# Altium schematic sheet Boost_Converter.SchDoc: Boost Converter Schematic
size A4; DrawnBy: Ian Glass; Revision: 1; SheetNumber: 2; SheetTotal: 3
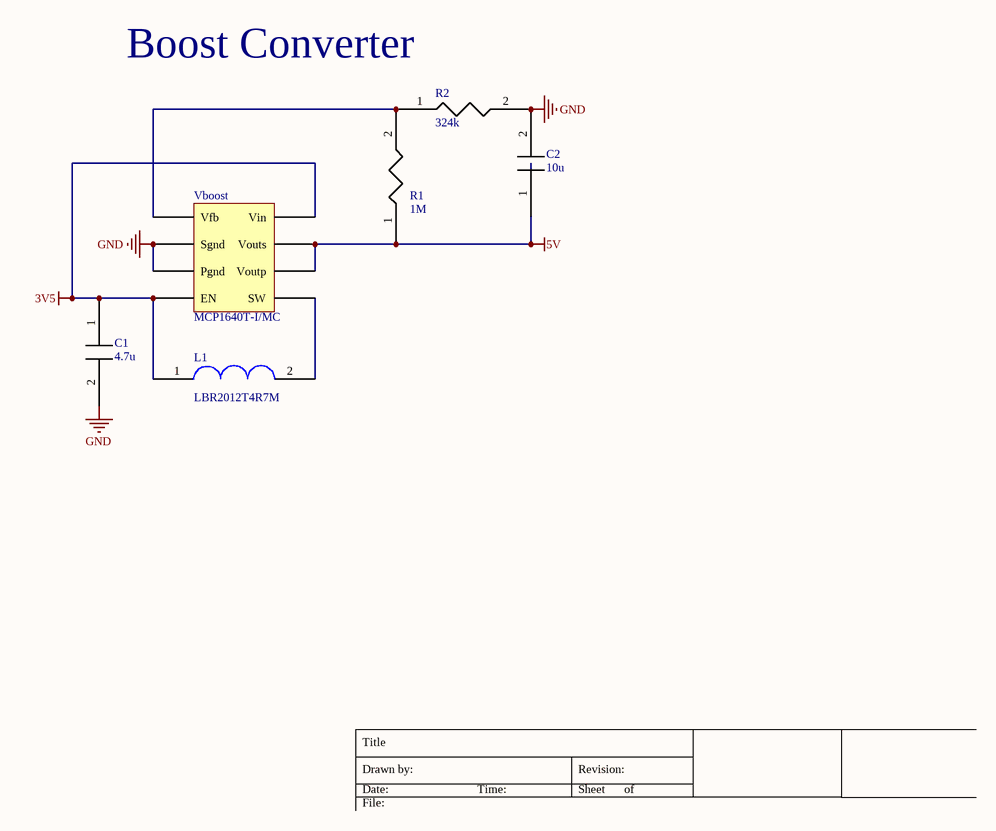
[diagram p0: Boost_Converter.SchDoc]

## Parts
C1  4.7u  [Capacitor 0805]
C2  10u  [Capacitor 0805]
L1  LBR2012T4R7M  [LBR2012T4R7M]
R1  1M  [Resistor 0403]
R2  324k  [Resistor 0603]
Vboost  MCP1640T-I/MC  [MCP1640T-I/MC]

## Nets
3V5: C1.1 L1.1 Vboost.4(EN) Vboost.8(Vin)
5V: C2.1 R1.1 Vboost.6(Voutp) Vboost.7(Vouts)
GND: C1.2 C2.2 R2.2 Vboost.2(Sgnd) Vboost.3(Pgnd)
NetL1_2: L1.2 Vboost.5(SW)
NetR1_2: R1.2 R2.1 Vboost.1(Vfb)

## Notes on the sheet
- (near R2) Boost Converter
- Title
- Drawn by:
- Date:
- Time:
- Revision:
- Sheet
- of
- File:

## Library data of the parts
C1 C2 = Capacitor 0805
R1 = Resistor 0403
R2 = Resistor 0603